# Altium schematic sheet Battery_manegment.SchDoc: Battery managment
size A4; Date: 11.11.2015; Engineer: Matjaz Tome; DocumentNumber: 3; Revision: B1; SheetNumber: 3; SheetTotal: 8; Project: USB DAQ
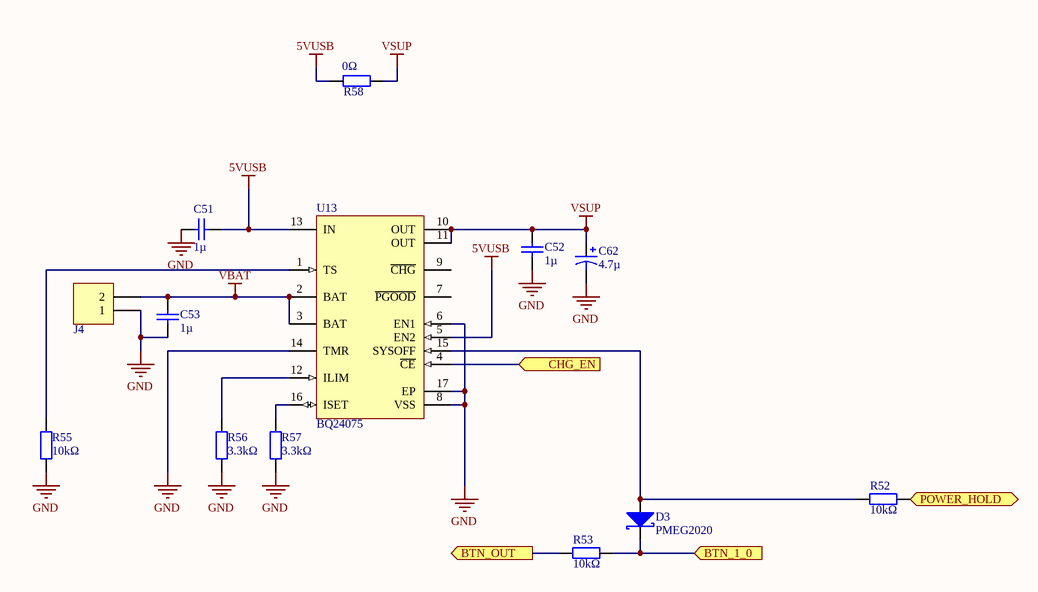
[diagram p0: Battery_manegment.SchDoc]

## Parts
C51  1µ  [0603C]
C52  1µ  [0603C]
C53  1µ  [0603C]
C62  4.7µ  [A]
D3  PMEG2020  [SOD323]
J4  B2B-PH-K-S(LF)(SN)  [JST_PH_2_V]  (value not drawn)
R52  10kΩ  [0603R]
R53  10kΩ  [0603R]
R55  10kΩ  [0603R]
R56  3.3kΩ  [0603R]
R57  3.3kΩ  [0603R]
R58  0Ω  [0603R]
U13  BQ24075  [QFN16_PAD]

## Ports
BTN_1_0 (in), BTN_OUT (out), CHG_EN (in), POWER_HOLD (in)

## Nets
5VUSB: C51.2 R58.1 U13.5(EN2) U13.13(IN)
GND: C51.1 C52.1 C53.1 C62.2 J4.1 R55.1 R56.1 R57.1 U13.6(EN1) U13.8(VSS) U13.14(TMR) U13.17(EP)
VBAT: C53.2 J4.2 U13.2(BAT) U13.3(BAT)
VSUP: C52.2 C62.1 R58.2 U13.10(OUT) U13.11(OUT)
BTN_1_0: D3.2(K) R53.1 ; port BTN_1_0
BTN_OUT: R53.2 ; port BTN_OUT
CHG_EN: U13.4(~{CE}) ; port CHG_EN
POWER_HOLD: R52.1 ; port POWER_HOLD
NetD3_1: D3.1(A) R52.2 U13.15(SYSOFF)
NetR55_2: R55.2 U13.1(TS)
NetR56_2: R56.2 U13.12(ILIM)
NetR57_2: R57.2 U13.16(ISET)

Not connected (* = marked no-connect by the designer): U13 7(~{PGOOD}) 9(~{CHG})

## Notes on the sheet
- Title
- Date
- Project
- Rev
- Engineer
- Sheet
- of

## Library data of the parts
C51-C53 = ZSC0003: ceramic X5R SMD capacitor smd 0603 1µF 50V; Manufacturer: Murata; Manufacturer Number: GRM188R61H105KAALD; Tolerance: 10%; Part Number: ZSC0003; Category: capacitors; Price: 0.144; Value: 1µF; Voltage: 50V; Case: 0603; Technology: SMT; Dielectric: X5R; HelpURL: U:\datasheet\cap\Murata\GRM\GRM188R61H105KAALD.pdf; SKU: 1020300000001; Supplier part number 1: 1845736; Supplier 1: Farnell
C62 = CST0011: tantalum SMD capacitor 4.7µF 16V A case; Manufacturer: Kemet; Manufacturer Number: T491A475M016AT; ESR: 4Ω; Tolerance: 10%; Part Number: CST0011; Category: Capacitors; Supplier part number 1: 2462769; Supplier 1: Farnell; Price: 0.20; Value: 4.7µF; Voltage: 16V; Case: A; Technology: SMT; Dielectric: Tantalum; HelpURL: U:\datasheet\cap\KEMET TANT SMD.pdf
D3 = XDS0004: Shotkey diode 2A 20V; Manufacturer: Infineon; Manufacturer Number: PMEG2020AEA; Part Number: XDS0004; Category: diodes; Price: 0.126; Max  Reverse Voltage: 20V; Max current: 2A; Case: SOD323; Technology: SMT; HelpURL: U:\datasheet\shotkey\PMEG2020.pdf; Supplier part number 1: 8737940; Supplier 1: Farnell
J4 = CJP0005: JST PH connector 2 poles vertical; Gender: male; Rows: 1; Pitch: 2mm; Lenght: 6mm; Part Number: CJP0005; Category: Connectors; Price: 0.116; Manufacturer: JST; Manufacturer Number: B2B-PH-K-S(LF)(SN); Pins: 2; Orientation: horizontal; Technology: THT; HelpURL: U:\datasheet\connectors_JST\JST_PH.pdf; Supplier part number 1: 9491856; Supplier 1: Farnell
R52 R53 R55 = YRS0016: resistor smd 0603 10kΩ 1% 0.1w; Manufacturer: Vishay; Manufacturer Number: CRCW060310K0FKEA; Dealer number: 1469748; Dealer: Farnell; Temperature coefficient: 100ppm; Part Number: YRS0016; Category: resistors; Price: 0.0143€; Value: 10kΩ; Power: 0.1W; Tolerance: 1%; Case: 0603; Technology: SMT; Material: Metal film - thick / Metal film; HelpURL: U:\datasheet\res\VISHAY CRCW0603.pdf; SKU: 1000000000002; Supplier 1: Farnell; Supplier part number 1: 1469748
R56 R57 = XRS0055: resistor smd 0603 3.3kΩ 5% 0.1w; Manufacturer: Yageo; Manufacturer Number: RC0603JR-073K3L; Temperature coefficient: 100ppm; Part Number: XRS0055; Category: resistors; Supplier part number 1: 9233440; Supplier 1: Farnell; Price: 0.0118; Value: 3.3kΩ; Power: 0.1W; Tolerance: 5%; Case: 0603; Technology: SMT; Material: Metal film / Metal film; HelpURL: U:\datasheet\res\YAGEO_2.pdf
R58 = XRS0022: resistor smd 0603 0Ω 5% 0.1w; Manufacturer: Panasonic; Manufacturer Number: ERJ3GEY0R00V; Temperature coefficient: 100ppm; Part Number: XRS0022; Category: resistors; Price: 0.009€; Value: 0Ω; Power: 0.1W; Tolerance: 5%; Case: 0603; Technology: SMT; Material: Metal film / Metal film; HelpURL: U:\datasheet\res\PANASONIC.pdf; Supplier part number 1: 2059527; Supplier 1: Farnell
U13 = BAC0000: 1.5-A USB-Friendly Li-Ion Battery Charger and Power-Path Management IC; Manufacturer: Texas Instruments; Manufacturer Number: BQ24075RGTT; Dealer number: 1754755; Dealer: Farnell; Part Number: BAC0000; Category: Integrated circuits; Price: 2.67; Technology: SMT; HelpURL: U:\datasheet\battery_chargers\bq2407x.pdf; Supplier 1: Farnell; Supplier part number 1: 1754755